# EAGLE design modicum (EAGLE 9.6.2)
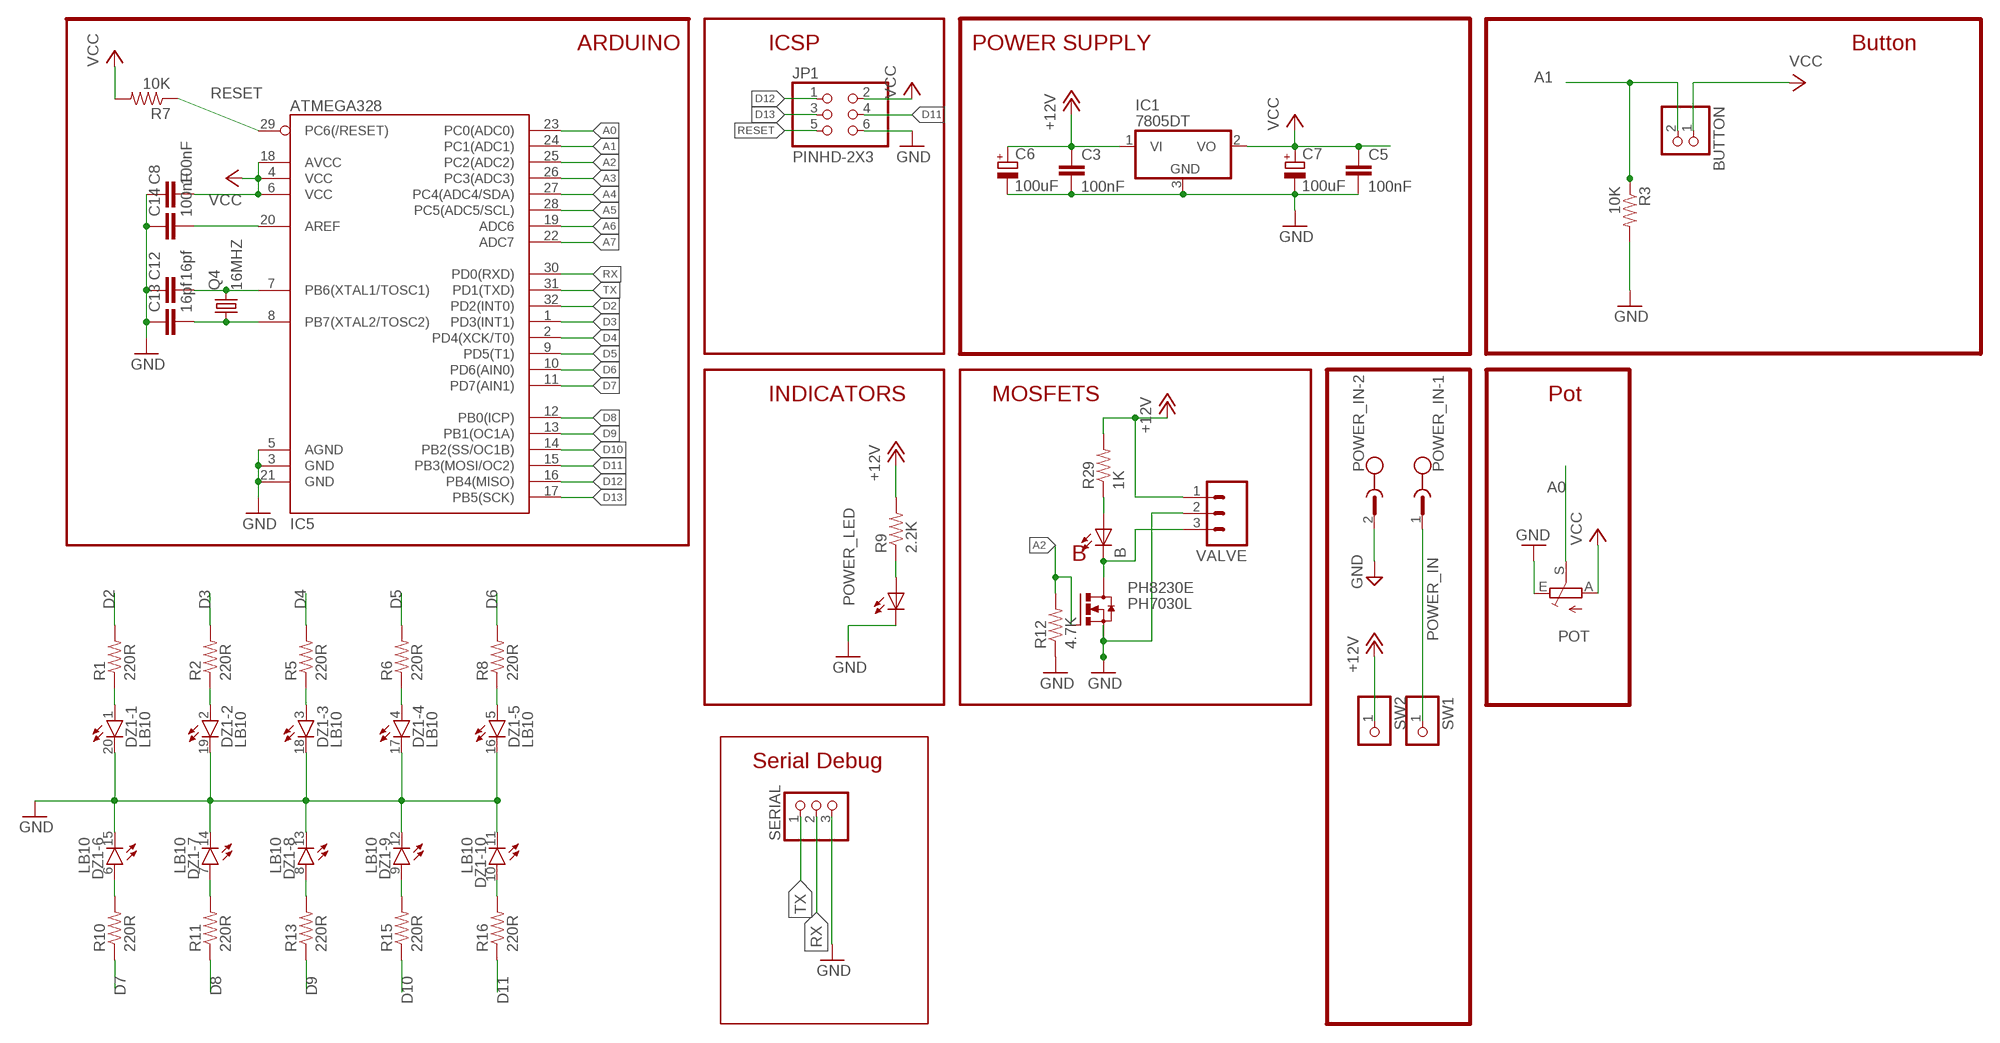
[diagram p0: schematic, sheet 1]

## Parts
B  LED0805  [LED-0805]
BUTTON  PINHD-1X2  [1X02]
C3  100nF  CAP0805  [0805]
C5  100nF  CAP0805  [0805]
C6  100uF  CPOL-EUE3.5-8  [E3,5-8]
C7  100uF  CPOL-EUE3.5-8  [E3,5-8]
C8  100nF  CAP0805  [0805]
C12  16pf  CAP0805  [0805]
C13  16pf  CAP0805  [0805]
C14  100nF  CAP0805  [0805]
DZ1  LB10  [LB10]
IC1  7805DT  [TO252]
IC5  ATMEGA328  ATMEGA168  [TQFP32-08]
JP1  PINHD-2X3  [2X03]
PH8230E  PH7030L  [SOT669]
POT  TRIM_EU-CIP20C-6MM  [CIP20C-6MM]
POWER_IN  MST2V  [MSTBV2]
POWER_LED  LED0805  [LED-0805]
Q4  16MHZ  CRYSTALHC49S  [HC49/S]
R1  220R  RESISTOR  [0805]
R2  220R  RESISTOR  [0805]
R3  10K  RESISTOR  [0805]
R5  220R  RESISTOR  [0805]
R6  220R  RESISTOR  [0805]
R7  10K  RESISTOR  [0805]
R8  220R  RESISTOR  [0805]
R9  2.2K  RESISTOR  [0805]
R10  220R  RESISTOR  [0805]
R11  220R  RESISTOR  [0805]
R12  4.7K  RESISTOR  [0805]
R13  220R  RESISTOR  [0805]
R15  220R  RESISTOR  [0805]
R16  220R  RESISTOR  [0805]
R29  1K  RESISTOR  [0805]
SERIAL  PINHD-1X3  [1X03]
SW1  PINHD-1X1  [1X01]
SW2  PINHD-1X1  [1X01]
VALVE  M03  [03P]

## Nets
+12V [motors]: C3.1 C6.+ IC1.1(VI) R9.2 R29.2 SW2.1 VALVE.1
A0: IC5.23(PC0(ADC0)) POT.S
A1: BUTTON.2 IC5.24(PC1(ADC1)) R3.1
A2: IC5.25(PC2(ADC2)) PH8230E.4(G) R12.2
A3: IC5.26(PC3(ADC3))
A4: IC5.27(PC4(ADC4/SDA))
A5: IC5.28(PC5(ADC5/SCL))
A6: IC5.19(ADC6)
A7: IC5.22(ADC7)
BPWR [motors]: B.C PH8230E.MB(D) VALVE.3
D2: IC5.32(PD2(INT0)) R1.2
D3: IC5.1(PD3(INT1)) R2.2
D4: IC5.2(PD4(XCK/T0)) R5.2
D5: IC5.9(PD5(T1)) R6.2
D6: IC5.10(PD6(AIN0)) R8.2
D7: IC5.11(PD7(AIN1)) R10.1
D8: IC5.12(PB0(ICP)) R11.1
D9: IC5.13(PB1(OC1A)) R13.1
D10: IC5.14(PB2(SS/OC1B)) R15.1
D11: IC5.15(PB3(MOSI/OC2)) JP1.4 R16.1
D12: IC5.16(PB4(MISO)) JP1.1
D13: IC5.17(PB5(SCK)) JP1.3
GND [motors]: C3.2 C5.2 C6.- C7.- C8.1 C12.1 C13.1 C14.1 DZ1.11(-10:C) DZ1.12(-9:C) DZ1.13(-8:C) DZ1.14(-7:C) DZ1.15(-6:C) DZ1.16(-5:C) DZ1.17(-4:C) DZ1.18(-3:C) DZ1.19(-2:C) DZ1.20(-1:C) IC1.3(GND) IC5.3(GND) IC5.5(AGND) IC5.21(GND) JP1.6 PH8230E.1(S) PH8230E.2(S) PH8230E.3(S) POT.E POWER_IN.2 POWER_LED.C R3.2 R12.1 SERIAL.3 VALVE.2
N$1: DZ1.1(-1:A) R1.1
N$2: DZ1.2(-2:A) R2.1
N$3: DZ1.3(-3:A) R5.1
N$4: DZ1.4(-4:A) R6.1
N$5: DZ1.5(-5:A) R8.1
N$6: DZ1.6(-6:A) R10.2
N$8: DZ1.7(-7:A) R11.2
N$9: DZ1.8(-8:A) R13.2
N$10: DZ1.9(-9:A) R15.2
N$11: DZ1.10(-10:A) R16.2
N$20: C14.2 IC5.20(AREF)
N$26: POWER_LED.A R9.1
N$31: C12.2 IC5.7(PB6(XTAL1/TOSC1)) Q4.2
N$32: C13.2 IC5.8(PB7(XTAL2/TOSC2)) Q4.1
N$42: B.A R29.1
POWER_IN: POWER_IN.1 SW1.1
RESET: IC5.29(PC6(/RESET)) JP1.5 R7.1
RX: IC5.30(PD0(RXD)) SERIAL.2
TX: IC5.31(PD1(TXD)) SERIAL.1
VCC: BUTTON.1 C5.1 C7.+ C8.2 IC1.2(VO) IC5.4(VCC) IC5.6(VCC) IC5.18(AVCC) JP1.2 POT.A R7.2

## Notes on the sheet
- ARDUINO | ICSP | POWER SUPPLY | Button
- INDICATORS | MOSFETS | Pot
- B
- Serial Debug

## Library data of the parts
B POWER_LED = SparkFun:LED: LEDs Standard schematic elements and footprints for 5mm, 3mm, 1206, and 0603 sized LEDs. 5mm - Spark Fun Electronics SKU : COM-00529 (and others)
BUTTON = pinhead:PINHD-1X2: PIN HEADER
C3 C5 C8 C12-C14 = SparkFun:CAP: Capacitor Standard 0603 ceramic capacitor, and 0.1" leaded capacitor.
C6 C7 = rcl:CPOL-EU: POLARIZED CAPACITOR, European symbol
DZ1 = led:LB10: LED BLOCK 10-LED bar graph, DIL, Siemens
IC1 = linear:78*: Positive VOLTAGE REGULATOR Source: http://cache.national.com/ds/LM/LM78L05.pdf http://www.fairchildsemi.com/ds/LM/LM7805.pdf
IC5 = SparkFun:ATMEGA168
JP1 = Connector:PINHD-2X3: PIN HEADER; CATEGORY: CONNECTOR; SUB-CATEGORY: PIN-HEADER
PH8230E = transistor-power:PH7030L: N-channel TrenchMOS (TM) logic level FET Source: http://www.nxp.com/acrobat_download/datasheets/PH7030L_4.pdf
POT = pot:TRIM_EU-: POTENTIOMETER
POWER_IN = con-phoenix-508:MST2V: PHOENIX
Q4 = crystal:CRYSTAL: CRYSTAL
R1-R3 R5-R13 R15 R16 R29 = SparkFun:RESISTOR: Resistor Basic schematic elements and footprints for 0603, 1206, and PTH 1/10th watt (small) resistors.
SERIAL = adafruit:PINHD-1X3: PIN HEADER
SW1 SW2 = pinhead:PINHD-1X1: PIN HEADER
VALVE = con-amp-quick:M03: AMP QUICK CONNECTOR; OC_FARNELL: unknown; OC_NEWARK: unknown

## Net classes
0 default: width 0.305 mm
1 vcc: width 0.254 mm
2 motors: width 1.016 mm

## Board
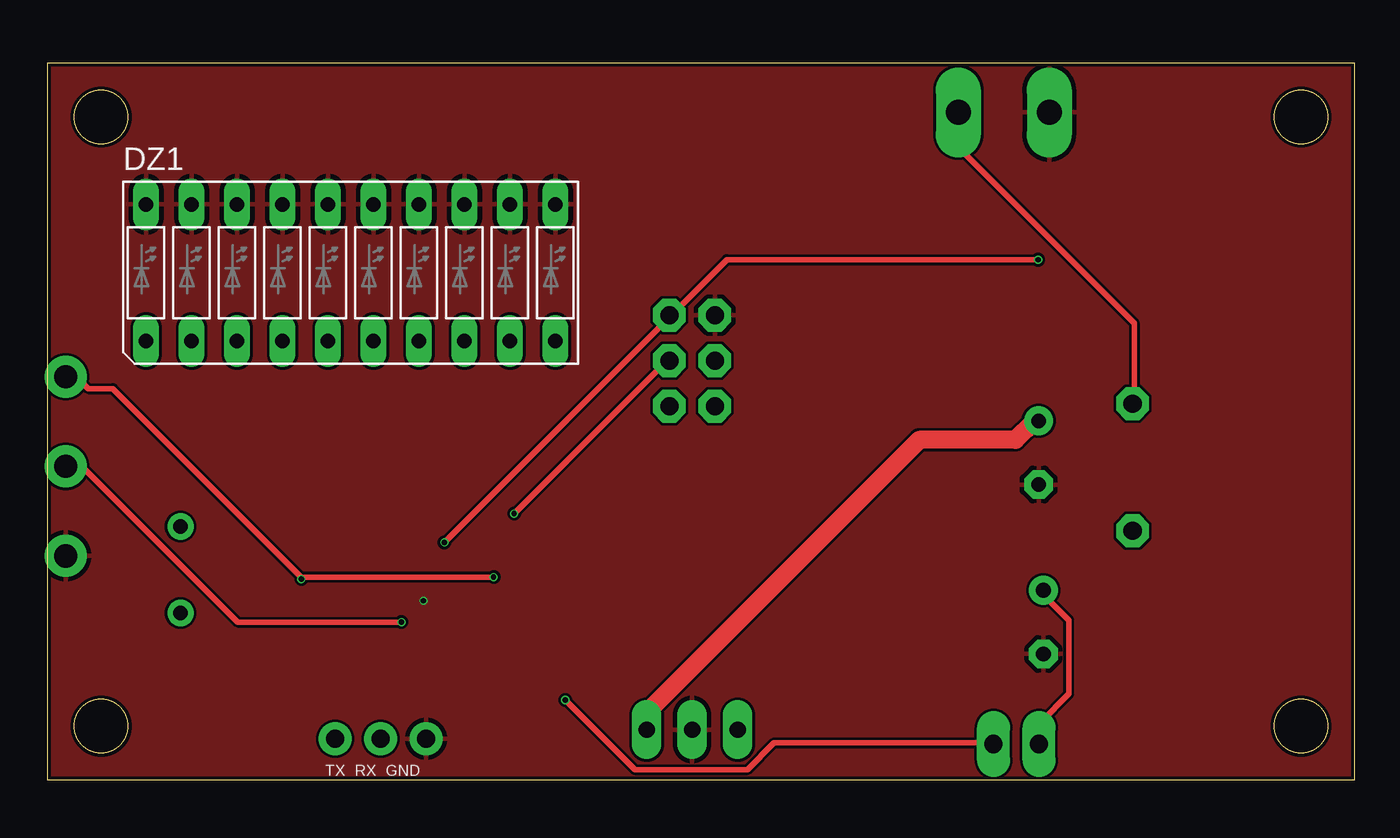
[diagram p1: board, top side]
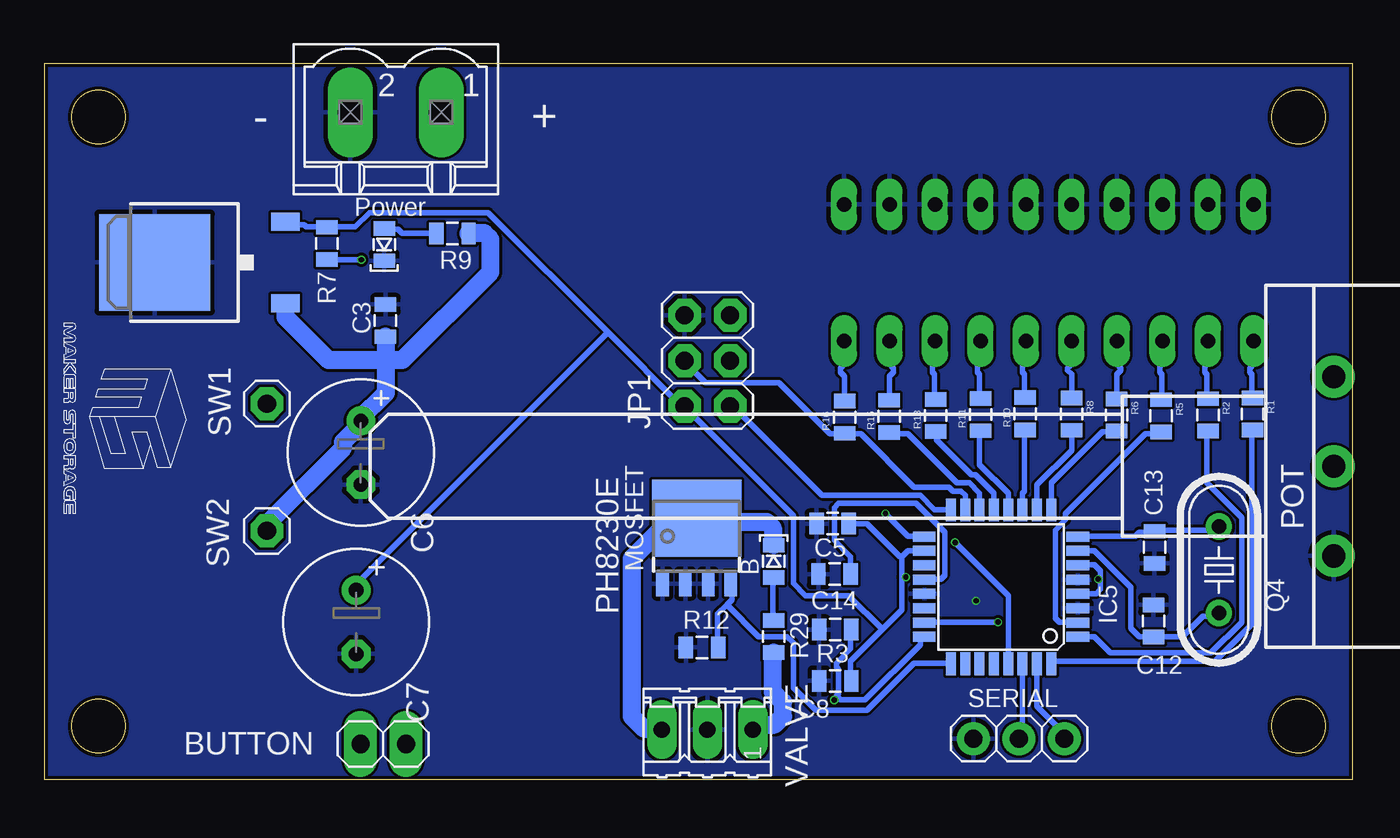
[diagram p2: board, bottom side, seen from below]

Size 73 x 40 mm. Coordinates in mm from the lower left corner, seen from the top.
Outline: 73,40 0,40 0,0 73,0 73,40
Outline: circle at 3,3 radius 1.5
Outline: circle at 70,37 radius 1.5
Outline: circle at 70,3 radius 1.5
Outline: circle at 3,37 radius 1.5
Outline: circle at 3,3 radius 1.5
Outline: circle at 70,37 radius 1.5
Outline: circle at 70,3 radius 1.5
Outline: circle at 3,37 radius 1.5
Copper layers (1*16): Top 0.035mm / dielectric 1.6mm / Bottom 0.035mm
Design rules "jlcpcb-2layers *": minimum track width 6mil, minimum drill 0.3mm, track to track 6mil, track to pad 6mil, pad to pad 6mil, via to via 6mil, smd to smd 6mil, copper to edge 0.2mm, drill to drill 6mil, minimum pad ring 10mil, minimum via ring 3mil, stop-mask expansion 4mil, vias tented up to drill 0mil, thermal gap 10mil

### Footprints (pad centres in the part's own frame; a part is rotated, then mirrored left to right if it is on the bottom)
LED-0805 = smd 1.2 x 0.8: A 0,-0.9; C 0,0.9
1X02 = drill 1.016 long: 1 -1.27,0; 2 1.27,0
0805 = smd 0.8 x 1.2: 1 -0.9,0; 2 0.9,0
E3,5-8 = drill 0.813 pad 1.6: + -1.778,0 | drill 0.813 pad 1.6 octagon: - 1.778,0
LB10 = drill 0.813 long: 1 -11.43,-3.81; 2 -8.89,-3.81; 3 -6.35,-3.81; 4 -3.81,-3.81; 5 -1.27,-3.81; 6 1.27,-3.81; 7 3.81,-3.81; 8 6.35,-3.81; 9 8.89,-3.81; 10 11.43,-3.81; 11 11.43,3.81; 12 8.89,3.81; 13 6.35,3.81; 14 3.81,3.81; 15 1.27,3.81; 16 -1.27,3.81; 17 -3.81,3.81; 18 -6.35,3.81; 19 -8.89,3.81; 20 -11.43,3.81
TO252 = smd 1 x 1.6: 1 -2.28,-4.8; 2 2.28,-4.8 | smd 5.4 x 6.2: 3 0,2.5
TQFP32-08 = smd 1.27 x 0.559: 1 -4.293,2.8; 2 -4.293,2; 3 -4.293,1.2; 4 -4.293,0.4; 5 -4.293,-0.4; 6 -4.293,-1.2; 7 -4.293,-2; 8 -4.293,-2.8; 17 4.293,-2.8; 18 4.293,-2; 19 4.293,-1.2; 20 4.293,-0.4; 21 4.293,0.4; 22 4.293,1.2; 23 4.293,2; 24 4.293,2.8 | smd 0.559 x 1.27: 9 -2.8,-4.293; 10 -2,-4.293; 11 -1.2,-4.293; 12 -0.4,-4.293; 13 0.4,-4.293; 14 1.2,-4.293; 15 2,-4.293; 16 2.8,-4.293; 25 2.8,4.293; 26 2,4.293; 27 1.2,4.293; 28 0.4,4.293; 29 -0.4,4.293; 30 -1.2,4.293; 31 -2,4.293; 32 -2.8,4.293
2X03 = drill 1.016 octagon: 1 -2.54,-1.27; 2 -2.54,1.27; 3 0,-1.27; 4 0,1.27; 5 2.54,-1.27; 6 2.54,1.27
SOT669 = smd 0.7 x 1.4: 1 -1.905,-2.65; 2 -0.635,-2.65; 3 0.635,-2.65; 4 1.905,-2.65 | smd 5 x 4.3: MB 0,1
CIP20C-6MM = drill 1.3 pad 1.93: A -5,0; E 5,0; S 0,0
MSTBV2 = drill 1.397 long: 1 -2.54,0; 2 2.54,0
HC49/S = drill 0.813: 1 -2.413,0; 2 2.413,0
1X03 = drill 1.016: 1 -2.54,0; 2 0,0; 3 2.54,0
1X01 = drill 1.016 octagon: 1 0,0
03P = drill 0.914 long: 1 -2.54,0; 2 0,0; 3 2.54,0

### Placement (x,y rotation side)
B  32.3,12.2 0 bottom
BUTTON  54.1,2 0 bottom
C3  53.97,25.64 90 bottom
C5  29,14.3 180 bottom
C6  55.35,18.26 270 bottom
C7  55.61,8.81 270 bottom
C8  28.86,5.53 0 bottom
C12  11.09,8.87 270 bottom
C13  11.03,12.98 90 bottom
C14  28.9,11.48 0 bottom
DZ1  16.94,28.31 0 top
IC1  64.36,28.88 90 bottom
IC5  19.6,10.78 180 bottom
JP1  36,23.4 90 bottom
PH8230E  36.6,13.6 0 bottom
POT  1.02,17.5 270 bottom
POWER_IN  53.4,37.26 180 bottom
POWER_LED  54.05,29.88 180 bottom
Q4  7.44,11.73 270 bottom
R1  5.55,20.42 270 bottom
R2  8.05,20.37 270 bottom
R3  28.86,8.39 180 bottom
R5  10.65,20.32 270 bottom
R6  13.15,20.37 270 bottom
R7  57.25,29.94 90 bottom
R8  15.65,20.42 270 bottom
R9  50.24,30.49 0 bottom
R10  18.25,20.44 90 bottom
R11  20.75,20.39 90 bottom
R12  36.3,7.4 0 bottom
R13  23.25,20.34 90 bottom
R15  25.84,20.29 90 bottom
R16  28.34,20.24 90 bottom
R29  32.3,8 270 bottom
SERIAL  18.6,2.3 180 bottom
SW1  60.6,21 0 bottom
SW2  60.6,13.9 0 bottom
VALVE  36,2.8 180 bottom

### Tracks (layer width: path | path; a pad name or v marks a point on that pad's centre or on a via)
+12V
  Top 1.016: VALVE.1 33.49,2.86 33.49,3.77 48.69,18.97 54.06,18.97 55.09,20 55.32,20 C6.+
  Bottom 1.016: R29.2 32.35,7.09 32.35,4.92 31.77,4.34 31.77,3.54 32.23,3.09 33.15,3.09 33.38,2.86 VALVE.1 | 53.95,23.43 53.95,21.6 55.44,20.12 C6.+ 55.55,19.66 56.35,18.86 56.35,18.52 60.58,14.29 60.58,13.95 SW2.1 | 53.95,23.43 53.95,24.69 C3.1 | R9.2 49.26,30.52 48.46,30.52 48.12,30.18 48.12,28.35 53.03,23.43 53.95,23.43 | 53.95,23.43 57.15,23.43 59.55,25.83 59.55,26.52 IC1.1
A0  (via drill 0.3)
  Top 0.305: v19.77,8.8 10.63,8.8 1.94,17.49 1.03,17.49 POT.S
  Bottom 0.305: v19.77,8.8 23.89,8.8 IC5.23
A1  (via drill 0.3)
  Top 0.305: v28.92,4.46 32.8,0.57 39.09,0.57 40.58,2.06 52.81,2.06 BUTTON.2
  Bottom 0.305: 28.8,4.69 28.69,4.8 28.69,6.17 28.8,6.29 28.8,6.51 28,7.32 28,8.34 R3.1 | 28.8,4.69 28.57,4.46 27.2,4.46 24.12,7.54 24.12,7.89 24,8 IC5.24 | v28.92,4.46 28.8,4.57 28.8,4.69
A2
  Bottom 0.305: 34.92,9.77 34.63,10.06 34.63,10.86 PH8230E.4 | 34.92,9.77 35.43,9.26 35.43,7.43 R12.2 | 34.92,9.77 33.15,8 31.55,8 31.2,7.66 31.2,5.14 29.95,3.89 27.09,3.89 24.46,6.51 22.4,6.51 IC5.25
BPWR
  Bottom 1.016: B.C 32.35,13.14 32.35,14.06 32.69,14.4 36.46,14.4 36.58,14.52 PH8230E.MB 37.03,14.29 38.29,14.29 40.23,12.34 40.23,3.54 39.55,2.86 38.63,2.86 VALVE.3
D2
  Bottom 0.305: R1.2 5.6,19.43 5.6,8.69 7.66,6.63 16.69,6.63 16.8,6.51 IC5.32
D3
  Bottom 0.305: R2.2 8.12,19.43 8.12,16.57 6.17,14.63 6.17,8.8 7.89,7.09 13.49,7.09 14.4,8 15.2,8 IC5.1
D4
  Bottom 0.305: R5.2 10.74,19.32 11.54,19.32 16,14.86 16,14.52 16.57,13.95 16.57,9.03 16.34,8.8 15.32,8.8 IC5.2
D5
  Bottom 0.305: R6.2 13.26,19.43 13.95,19.43 16.8,16.57 16.8,15.09 IC5.9
D6
  Bottom 0.305: R8.2 15.66,19.43 15.66,18.4 17.6,16.46 17.6,15.09 IC5.10
D7
  Bottom 0.305: R10.1 18.29,19.43 18.29,16.12 18.4,16 18.4,15.09 IC5.11
D8
  Bottom 0.305: R11.1 20.8,19.43 20.8,17.6 19.2,16 19.2,15.09 IC5.12
D9
  Bottom 0.305: R13.1 23.2,19.43 23.2,18.97 21.26,17.03 21.03,17.03 20,16 20,15.09 IC5.13
D10
  Bottom 0.305: R15.1 25.83,19.32 24.8,19.32 22.06,16.57 21.37,16.57 20.8,16 20.8,15.09 IC5.14
D11
  Bottom 0.305: IC5.15 21.6,15.09 21.6,15.89 21.83,16.12 22.29,16.12 22.52,16.34 24.46,16.34 27.43,19.32 28.23,19.32 R16.1 28.46,19.32 29.15,19.32 32,22.17 36.12,22.17 37.26,23.32 JP1.4
D12
  Bottom 0.305: IC5.16 22.4,15.09 23.32,15.09 24.12,15.89 29.6,15.89 34.63,20.92 JP1.1
D13  (via drill 0.3)
  Top 0.305: v26.06,14.86 34.63,23.43 JP1.3
  Bottom 0.305: v26.06,14.86 24.8,13.6 24,13.6 IC5.17
GND  (via drill 0.3)
  other vias: 21,10
  pour Top: -1,45 75,45 75,-4 -1,-4
  pour Bottom: -6,50 80,50 80,-10 -6,-10
N$1
  Bottom 0.305: R1.1 5.6,21.37 5.6,22.63 5.71,22.75 5.71,22.97 5.6,23.09 5.6,24.46 DZ1.1
N$2
  Bottom 0.305: R2.1 8.12,21.37 8.12,22.63 8.23,22.75 8.23,23.09 8.12,23.2 8.12,24.46 DZ1.2
N$3
  Bottom 0.305: R5.1 10.63,21.26 10.63,22.63 10.74,22.75 10.74,23.09 10.63,23.2 10.63,24.46 DZ1.3
N$4
  Bottom 0.305: R6.1 13.14,21.37 13.14,22.63 12.92,22.86 12.92,22.97 13.03,23.09 13.03,24.46 DZ1.4
N$5
  Bottom 0.305: R8.1 15.66,21.37 15.66,22.63 15.89,22.86 15.89,22.97 15.77,23.09 15.77,24.46 DZ1.5
N$6
  Bottom 0.305: R10.2 18.29,21.37 18.29,22.63 18.4,22.75 18.4,23.09 18.29,23.2 18.29,24.46 DZ1.6
N$8
  Bottom 0.305: R11.2 20.8,21.37 20.8,22.63 20.92,22.75 20.92,23.09 20.8,23.2 20.8,24.46 DZ1.7
N$9
  Bottom 0.305: R13.2 23.32,21.26 23.32,22.63 23.43,22.75 23.43,23.09 23.32,23.2 23.32,24.46 DZ1.8
N$10
  Bottom 0.305: R15.2 25.83,21.26 25.83,22.52 25.6,22.75 25.6,22.97 25.72,23.09 25.72,24.46 DZ1.9
N$11
  Bottom 0.305: R16.2 28.35,22.52 28.57,22.75 28.57,22.97 28.46,23.09 28.46,24.46 DZ1.10
N$20
  Bottom 0.305: C14.2 28,11.54 28,12.46 28.92,13.37 28.92,15.2 28.69,15.43 24.35,15.43 22.75,13.83 22.75,11.43 22.97,11.2 23.89,11.2 IC5.20
N$26
  Bottom 0.305: R9.1 51.21,30.52 53.03,30.52 53.26,30.75 53.95,30.75 POWER_LED.A
N$31
  Bottom 0.305: Q4.2 7.54,9.26 8,9.26 8.12,9.14 8.34,9.14 9.49,8 11.09,8 C12.2 11.2,8 11.89,8 12.34,8.46 12.34,10.74 14.4,12.8 15.2,12.8 IC5.7
N$32
  Bottom 0.305: Q4.1 7.54,14.06 8,14.06 8.12,13.95 10.97,13.95 C13.2 11.09,13.83 11.89,13.83 12.12,13.6 15.2,13.6 IC5.8
N$42
  Bottom 0.305: R29.1 32.35,8.91 32.35,11.2 B.A
POWER_IN
  Top 0.305: SW1.1 60.69,21.03 60.69,25.49 50.86,35.32 50.86,37.15 POWER_IN.1
RESET  (via drill 0.3)
  Top 0.305: v55.32,29.03 37.95,29.03 34.75,25.83 | 34.75,25.83 v22.17,13.26 | 34.75,25.83 JP1.5
  Bottom 0.305: v55.32,29.03 57.15,29.03 R7.1 | v22.17,13.26 19.2,10.29 19.2,6.51 IC5.29
RX
  Bottom 0.305: IC5.30 18.4,6.4 18.4,3.2 18.52,3.09 18.52,2.4 SERIAL.2
TX
  Bottom 0.305: IC5.31 17.6,6.4 17.6,4.12 16.12,2.63 16.12,2.4 SERIAL.1
VCC  (via drill 0.3)
  Top 0.305: POT.A 1.03,22.4 1.71,22.4 2.29,21.83 3.66,21.83 14.17,11.32 v14.17,11.2 14.29,11.32 v24.92,11.32 | C7.+ 55.66,10.52 55.66,10.29 57.04,8.91 57.04,4.8 55.44,3.2 55.44,2.06 BUTTON.1
  Bottom 0.305: 14.06,11.2 14.06,11.66 14.4,12 15.2,12 IC5.6 | 14.06,11.2 14.06,10.63 14.29,10.4 15.2,10.4 IC5.4 | v14.17,11.2 14.06,11.2 | 26.23,8.4 25.15,9.49 25.15,11.32 | 26.23,8.4 28,6.63 28,5.6 C8.2 | 25.15,12.46 25.15,11.32 | 25.15,12.46 24.8,12.8 24,12.8 IC5.18 | C5.1 28,14.29 27.09,14.29 25.26,12.46 25.15,12.46 | IC1.2 59.55,31.09 59.44,30.98 58.52,30.98 58.41,30.86 57.26,30.86 R7.2 57.15,30.86 55.66,30.86 54.86,31.66 48.23,31.66 41.55,24.98 | 41.55,24.98 37.38,20.8 JP1.2 37.26,20.8 31.2,14.74 31.2,10.97 30.52,10.29 28.12,10.29 26.23,8.4 | 41.55,24.98 55.55,10.97 55.55,10.63 C7.+ | v24.92,11.32 25.15,11.32

### Text on the board
bPlace: + | - | Power | MOSFET
tNames: TX RX GND